# Altium schematic sheet JetsonXavier_v1.SchDoc
size A2
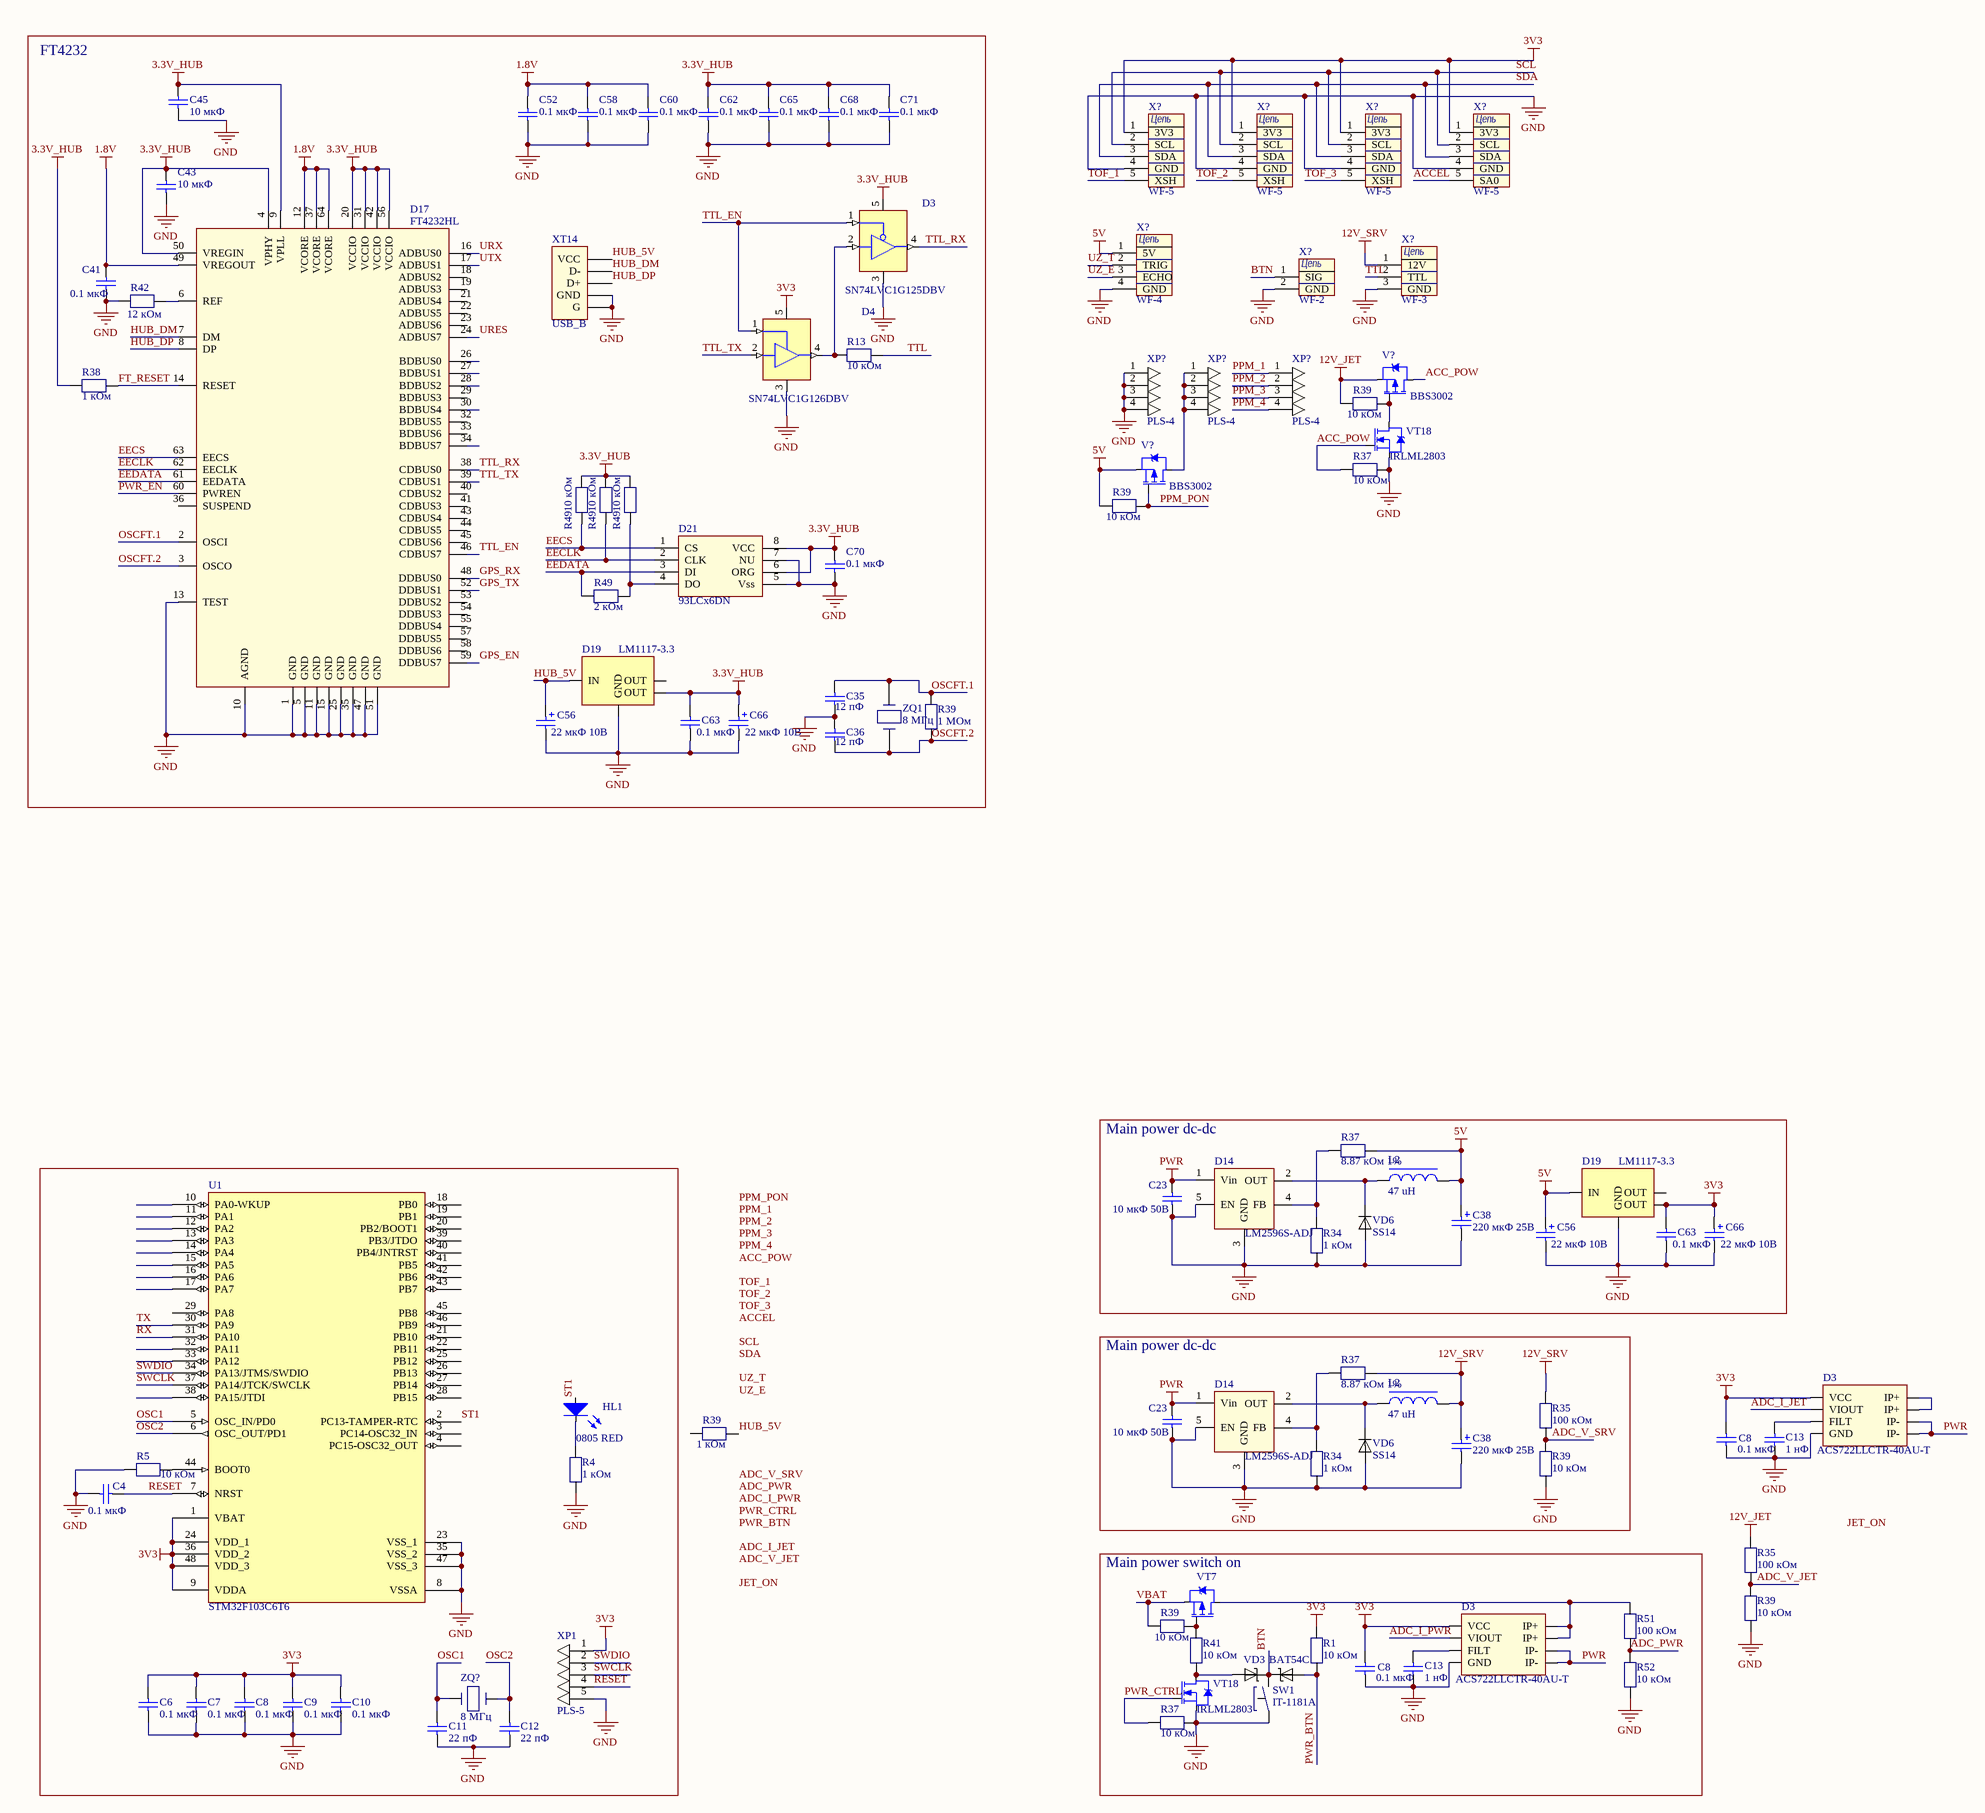
[diagram p0: JetsonXavier_v1.SchDoc]

## Parts
(Parts that share a designator on the sheet are numbered #1, #2 ... from top to bottom, then left to right.)
C4  value 0.1 мкФ  [0805]  (hidden comment: C0805)
C6  value 0.1 мкФ  [0805]  (hidden comment: C0805)
C7  value 0.1 мкФ  [0805]  (hidden comment: C0805)
C8#1  value 0.1 мкФ  [0805]  (hidden comment: C0805)
C8#2  value 0.1 мкФ  [0805]  (hidden comment: C0805)
C8#3  value 0.1 мкФ  [0805]  (hidden comment: C0805)
C9  value 0.1 мкФ  [0805]  (hidden comment: C0805)
C10  value 0.1 мкФ  [0805]  (hidden comment: C0805)
C11  value 22 пФ  [0805]  (hidden comment: C0805)
C12  value 22 пФ  [0805]  (hidden comment: C0805)
C13#1  value 1 нФ  [0805]  (hidden comment: C0805)
C13#2  value 1 нФ  [0805]  (hidden comment: C0805)
C23#1  value 10 мкФ 50В  [1206]  (hidden comment: C1206)
C23#2  value 10 мкФ 50В  [1206]  (hidden comment: C1206)
C35  value 12 пФ  [0805]  (hidden comment: C0805)
C36  value 12 пФ  [0805]  (hidden comment: C0805)
C38#1  220 мкФ 25В  [CAPPR3.5-8x12]
C38#2  220 мкФ 25В  [CAPPR3.5-8x12]
C41  value 0.1 мкФ  [0805]  (hidden comment: C0805)
C43  value 10 мкФ  [0805]  (hidden comment: C0805)
C45  value 10 мкФ  [0805]  (hidden comment: C0805)
C52  value 0.1 мкФ  [0805]  (hidden comment: C0805)
C56#1  22 мкФ 10В  [Case-B]
C56#2  22 мкФ 10В  [Case-B]
C58  value 0.1 мкФ  [0805]  (hidden comment: C0805)
C60  value 0.1 мкФ  [0805]  (hidden comment: C0805)
C62  value 0.1 мкФ  [0805]  (hidden comment: C0805)
C63#1  value 0.1 мкФ  [0805]  (hidden comment: C0805)
C63#2  value 0.1 мкФ  [0805]  (hidden comment: C0805)
C65  value 0.1 мкФ  [0805]  (hidden comment: C0805)
C66#1  22 мкФ 10В  [Case-B]
C66#2  22 мкФ 10В  [Case-B]
C68  value 0.1 мкФ  [0805]  (hidden comment: C0805)
C70  value 0.1 мкФ  [0805]  (hidden comment: C0805)
C71  value 0.1 мкФ  [0805]  (hidden comment: C0805)
D3#1  SN74LVC1G125DBV  [SOT23-5]
D3#2  ACS722LLCTR-40AU-T  [SOIC-8]
D3#3  ACS722LLCTR-40AU-T  [SOIC-8]
D4  SP: SN74LVC1G126DBV  [SOT23-5]  (hidden comment: SN74LVC1G126DBV_1)
D14#1  LM2596S-ADJ  [TO-263]
D14#2  LM2596S-ADJ  [TO-263]
D17  FT4232HL  [FT4232HL]
D19#1  LM1117-3.3  [SOT223]
D19#2  LM1117-3.3  [SOT223]
D21  93LCx6DN  [SOIC-8]
HL1  0805 RED  [LED0805]
L2#1  47 uH  [CDRH127]
L2#2  47 uH  [CDRH127]
R1  10 кОм  [R0603]
R4  value 1 кОм  [P0805]  (hidden comment: R0805 (1%))
R5  value 10 кОм  [P0805]  (hidden comment: R0805)
R13  value 10 кОм  [P0805]  (hidden comment: R0805 (1%))
R34#1  value 1 кОм  [P0805]  (hidden comment: R0805 (1%))
R34#2  value 1 кОм  [P0805]  (hidden comment: R0805 (1%))
R35#1  value 100 кОм  [P0805]  (hidden comment: R0805 (1%))
R35#2  value 100 кОм  [P0805]  (hidden comment: R0805 (1%))
R37#1  value 10 кОм  [P0805]  (hidden comment: R0805)
R37#2  value 8.87 кОм 1%  [P0805]  (hidden comment: R0805 (1%))
R37#3  value 8.87 кОм 1%  [P0805]  (hidden comment: R0805 (1%))
R37#4  value 10 кОм  [P0805]  (hidden comment: R0805)
R38  value 1 кОм  [P0805]  (hidden comment: R0805)
R39#1  value 10 кОм  [P0805]  (hidden comment: R0805 (1%))
R39#2  value 10 кОм  [P0805]  (hidden comment: R0805 (1%))
R39#3  value 1 МОм  [P0805]  (hidden comment: R0805)
R39#4  value 1 кОм  [P0805]  (hidden comment: R0805 (1%))
R39#5  value 10 кОм  [P0805]  (hidden comment: R0805 (1%))
R39#6  value 10 кОм  [P0805]  (hidden comment: R0805 (1%))
R39#7  value 10 кОм  [P0805]  (hidden comment: R0805 (1%))
R41  value 10 кОм  [P0805]  (hidden comment: R0805 (1%))
R42  value 12 кОм  [P0805]  (hidden comment: R0805)
R49#1  value 10 кОм  [P0805]  (hidden comment: R0805)
R49#2  value 10 кОм  [P0805]  (hidden comment: R0805)
R49#3  value 10 кОм  [P0805]  (hidden comment: R0805)
R49#4  value 2 кОм  [P0805]  (hidden comment: R0805)
R51  value 100 кОм  [P0805]  (hidden comment: R0805 (1%))
R52  value 10 кОм  [P0805]  (hidden comment: R0805 (1%))
SW1  IT-1181A  [IT-1181A]
U1  STM32F103C6T6  [LQFP-48]
V?#1  BBS3002  [TO-263-2]
V?#2  BBS3002  [TO-263-2]
VD3  BAT54C  [SOT-23]
VD6#1  SS14  [SMA]
VD6#2  SS14  [SMA]
VT7  D2PAK_P_CH  [TO-263-2]  (value not drawn)
VT18#1  IRLML2803  [SOT-23]
VT18#2  IRLML2803  [SOT-23]
X?#1  WF-5  [WF-5]
X?#2  WF-5  [WF-5]
X?#3  WF-5  [WF-5]
X?#4  WF-5  [WF-5]
X?#5  WF-4  [WF-4]
X?#6  WF-3  [WF-3]
X?#7  WF-2  [WF-2]
XP1  PLS-5  [PLS-5]
XP?#1  PLS-4  [PLS-4]
XP?#2  PLS-4  [PLS-4]
XP?#3  PLS-4  [PLS-4]
XT14  USB_B  [USB_B]
ZQ1  8 МГц  [HC-49/U]
ZQ?  8 МГц  [HC-49/U]

## Blocks framed on the sheet
FT4232: C35 C36 C41 C43 C45 C52 C56#1 C58 C60 C62 C63#1 C65 C66#1 C68 C70 C71 D3#1 D4 D17 D19#1 D21 R13 R38 R39#3 R42 R49#1-R49#4 XT14 ZQ1
Main power dc-dc: C23#1 C38#1 C56#2 C63#2 C66#2 D14#1 D19#2 L2#1 R34#1 R37#2 VD6#1
Main power dc-dc: C23#2 C38#2 D14#2 L2#2 R34#2 R35#1 R37#3 R39#5 VD6#2
Main power switch on: C8#2 C13#2 D3#3 R1 R37#4 R39#7 R41 R51 R52 SW1 VD3 VT7 VT18#2

## Nets
1.8V: C41.2 C52.2 C58.2 C60.2 D17.12(VCORE) D17.37(VCORE) D17.49(VREGOUT) D17.64(VCORE)
3.3V_HUB: C43.2 C45.2 C62.2 C63#1.2 C65.2 C66#1.1 C68.2 C70.2 C71.2 D3#1.5(VCC) D17.4(VPHY) D17.9(VPLL) D17.20(VCCIO) D17.31(VCCIO) D17.42(VCCIO) D17.50(VREGIN) D17.56(VCCIO) D19#1.4(OUT) D21.6(ORG) D21.8(VCC) R38.2 R49#1.1 R49#2.1 R49#3.1
3V3: C6.2 C7.2 C8#1.1 C8#2.1 C8#3.2 C9.2 C10.2 C63#2.2 C66#2.1 D3#2.8(VCC) D3#3.8(VCC) D4.5(VCC) D19#2.4(OUT) R1.2 U1.1(VBAT) U1.9(VDDA) U1.24(VDD_1) U1.36(VDD_2) U1.48(VDD_3) X?#1.1(3V3) X?#2.1(3V3) X?#3.1(3V3) X?#4.1(3V3) XP1.1
5V: C38#1.1 C56#2.1 D19#2.3(IN) L2#1.2 R37#2.1 R39#2.1 V?#2.3(S) X?#5.1(5V)
12V_JET: R35#2.2 R39#1.1 V?#1.3(S)
12V_SRV: C38#2.1 L2#2.2 R35#1.2 R37#3.1 X?#6.1(12V)
GND: C4.2 C6.1 C7.1 C8#1.2 C8#2.2 C8#3.1 C9.1 C10.1 C11.1 C12.1 C13#1.1 C13#2.1 C23#1.2 C23#2.2 C35.1 C36.2 C38#1.2 C38#2.2 C41.1 C43.1 C45.1 C52.1 C56#1.2 C56#2.2 C58.1 C60.1 C62.1 C63#1.1 C63#2.1 C65.1 C66#1.2 C66#2.2 C68.1 C70.1 C71.1 D3#1.3(GND) D3#2.5(GND) D3#3.5(GND) D4.3(GND) D14#1.3(GND) D14#1.5(EN) D14#2.3(GND) D14#2.5(EN) D17.1(GND) D17.5(GND) D17.10(AGND) D17.11(GND) D17.13(TEST) D17.15(GND) D17.25(GND) D17.35(GND) D17.47(GND) D17.51(GND) D19#1.1(GND) D19#2.1(GND) D21.5(Vss) D21.7(NU) R4.1 R5.2 R34#1.1 R34#2.1 R37#1.1 R37#4.1 R39#5.2 R39#6.2 R42.2 R52.2 SW1.1 U1.8(VSSA) U1.23(VSS_1) U1.35(VSS_2) U1.47(VSS_3) VD6#1.2(A) VD6#2.2(A) VT18#1.2(S) VT18#2.2(S) X?#1.4(GND) X?#2.4(GND) X?#3.4(GND) X?#4.4(GND) X?#5.4(GND) X?#6.3(GND) X?#7.2(GND) XP1.5 XP?#1.1 XP?#1.2 XP?#1.3 XP?#1.4 XT14.4(GND) XT14.G
PWR: C23#1.1 C23#2.1 D3#2.3(IP-) D3#2.4(IP-) D3#3.3(IP-) D3#3.4(IP-) D14#1.1(Vin) D14#2.1(Vin)
ACC_POW: R37#1.2 V?#1.2(D) VT18#1.1(G)
ACCEL: X?#4.5(SA0)
ADC_I_JET: D3#2.7(VIOUT)
ADC_I_PWR: D3#3.7(VIOUT)
ADC_PWR: R51.1 R52.1
ADC_V_JET: R35#2.1 R39#6.1
ADC_V_SRV: R35#1.1 R39#5.1
BTN: SW1.2 VD3.3(K) X?#7.1(SIG)
EECLK: D17.62(EECLK) D21.2(CLK) R49#2.2
EECS: D17.63(EECS) D21.1(CS) R49#1.2
EEDATA: D17.61(EEDATA) D21.3(DI) R49#4.2
FT_RESET: D17.14(RESET) R38.1
GPS_EN: D17.59(DDBUS7)
GPS_RX: D17.48(DDBUS0)
GPS_TX: D17.52(DDBUS1)
HUB_5V: C56#1.1 D19#1.3(IN) R39#4.2 XT14.1(VCC)
HUB_DM: D17.7(DM) XT14.2(D-)
HUB_DP: D17.8(DP) XT14.3(D+)
OSC1: C11.2 U1.5(OSC_IN/PD0) ZQ?.1
OSC2: C12.2 U1.6(OSC_OUT/PD1) ZQ?.2
OSCFT.1: C35.2 D17.2(OSCI) R39#3.1 ZQ1.2
OSCFT.2: C36.1 D17.3(OSCO) R39#3.2 ZQ1.1
PPM_1: XP?#3.1
PPM_2: XP?#3.2
PPM_3: XP?#3.3
PPM_4: XP?#3.4
PPM_PON: R39#2.2 V?#2.1(G)
PWR_BTN: R1.1 VD3.2(A)
PWR_CTRL: R37#4.2 VT18#2.1(G)
PWR_EN: D17.60(PWREN)
RESET: C4.1 U1.7(NRST) XP1.4
RX: U1.31(PA10)
SCL: X?#1.2(SCL) X?#2.2(SCL) X?#3.2(SCL) X?#4.2(SCL)
SDA: X?#1.3(SDA) X?#2.3(SDA) X?#3.3(SDA) X?#4.3(SDA)
ST1: HL1.1(A) U1.2(PC13-TAMPER-RTC)
SWCLK: U1.37(PA14/JTCK/SWCLK) XP1.3
SWDIO: U1.34(PA13/JTMS/SWDIO) XP1.2
TOF_1: X?#1.5(XSH)
TOF_2: X?#2.5(XSH)
TOF_3: X?#3.5(XSH)
TTL: R13.2 X?#6.2(TTL)
TTL_EN: D3#1.1(A) D4.1(A) D17.46(CDBUS7)
TTL_RX: D3#1.4(OUT) D17.38(CDBUS0)
TTL_TX: D4.2(B) D17.39(CDBUS1)
TX: U1.30(PA9)
URES: D17.24(ADBUS7)
URX: D17.16(ADBUS0)
UTX: D17.17(ADBUS1)
UZ_E: X?#5.3(ECHO)
UZ_T: X?#5.2(TRIG)
VBAT: R39#7.1 VT7.3(S)
NetC13#1_2: C13#1.2 D3#2.6(FILT)
NetC13#2_2: C13#2.2 D3#3.6(FILT)
NetD3#1_2: D3#1.2(B) D4.4(OUT) R13.1
NetD3#2_1: D3#2.1(IP+) D3#2.2(IP+)
NetD3#3_1: D3#3.1(IP+) D3#3.2(IP+) R51.2 VT7.2(D)
NetD14#1_2: D14#1.2(OUT) L2#1.1 VD6#1.1(K)
NetD14#1_4: D14#1.4(FB) R34#1.2 R37#2.2
NetD14#2_2: D14#2.2(OUT) L2#2.1 VD6#2.1(K)
NetD14#2_4: D14#2.4(FB) R34#2.2 R37#3.2
NetD17_6: D17.6(REF) R42.1
NetD21_4: D21.4(DO) R49#3.2 R49#4.1
NetHL1_2: HL1.2(C) R4.2
NetR5_1: R5.1 U1.44(BOOT0)
NetR39#1_2: R39#1.2 V?#1.1(G) VT18#1.3(D)
NetR39#7_2: R39#7.2 R41.1 VT7.1(G)
NetR41_2: R41.2 VD3.1(A) VT18#2.3(D)
NetV?#2_2: V?#2.2(D) XP?#2.1 XP?#2.2 XP?#2.3 XP?#2.4

Not connected (* = marked no-connect by the designer): D17 18(ADBUS2) 19(ADBUS3) 21(ADBUS4) 22(ADBUS5) 23(ADBUS6) 26(BDBUS0) 27(BDBUS1) 28(BDBUS2) 29(BDBUS3) 30(BDBUS4) 32(BDBUS5) 33(BDBUS6) 34(BDBUS7) 36(SUSPEND) 40(CDBUS2) 41(CDBUS3) 43(CDBUS4) 44(CDBUS5) 45(CDBUS6) 53(DDBUS2) 54(DDBUS3) 55(DDBUS4) 57(DDBUS5) 58(DDBUS6); D19#1 2(OUT); D19#2 2(OUT); R39#4 1; U1 3(PC14-OSC32_IN) 4(PC15-OSC32_OUT) 10(PA0-WKUP) 11(PA1) 12(PA2) 13(PA3) 14(PA4) 15(PA5) 16(PA6) 17(PA7) 18(PB0) 19(PB1) 20(PB2/BOOT1) 21(PB10) 22(PB11) 25(PB12) 26(PB13) 27(PB14) 28(PB15) 29(PA8) 32(PA11) 33(PA12) 38(PA15/JTDI) 39(PB3/JTDO) 40(PB4/JNTRST) 41(PB5) 42(PB6) 43(PB7) 45(PB8) 46(PB9)

## Notes on the sheet
- Labels drawn without touching a wire or pin: ACC_POW, ACCEL, ADC_I_JET, ADC_I_PWR, ADC_PWR, ADC_V_JET, ADC_V_SRV, JET_ON, PPM_1, PPM_2, PPM_3, PPM_4, PPM_PON, PWR_BTN, PWR_CTRL, SCL, SDA, TOF_1, TOF_2, TOF_3, UZ_E, UZ_T
- (in symbol WF-2) Цепь
- (in symbol WF-3) Цепь
- (in symbol WF-4) Цепь
- (in symbol WF-5) Цепь

## Library data of the parts
C4 C6 C7 C8#1-C8#3 C9-C12 C13#1 C13#2 C35 C36 C41 C43 C45 C52 C58 C60 C62 C63#1 C63#2 C65 C68 C70 C71 = C0805: Чип конденсатор 0805; SP: Чип конденсатор 0805 X7R
C23#1 C23#2 = C1206: Чип конденсатор 1206; SP: Чип конденсатор 1206 X7R
C38#1 C38#2 = K50-35: Чип конденсатор танталовый "A"; SP: Конденсатор  SH025M0220A5S-0811; Value: 220 мкФ 25В
C56#1 C56#2 C66#1 C66#2 = Tantal "B": Чип конденсатор танталовый "B"; SP: Чип конденсатор Tantal "B"; Value: 22 мкФ 10В
D3#2 D3#3 = ACS712: SP: ACS722LLCTR-40AU-T
D14#1 D14#2 = LM2596S-ADJ: SP: Микросхема LM2596S-ADJ
D19#1 D19#2 = LM1117: SP: LM1117-3.3
D21 = 93LC46: Microwire Serial EEPROM; Value: EEPROM; SP: 93LCx6DN
HL1 = LED: Value: 0805 RED
L2#1 L2#2 = CDRH127/LDNP-330MC: SMD Дроссель 12x12 mm; SP: CDRH127/LDNP-330MC; Value: 47 uH
R1 = R0603: Чип резистор 0603; SP: Чип резистор 0603; FootPrint: 0603; Value: 10 кОм
R4 R13 R34#1 R34#2 R35#1 R35#2 R37#2 R37#3 R39#1 R39#2 R39#4-R39#7 R41 R51 R52 = R0805 (1%): Чип резистор 0805, 1%; SP: Чип резистор 0805
R5 R37#1 R37#4 R38 R39#3 R42 R49#1-R49#4 = R0805: Чип резистор 0805, 1%; SP: Чип резистор 0805
SW1 = SWT-1: SP: IT-1181A
U1 = STM32F103C6T6: STM32 ARM-based 32-bit MCU with 32 Kbytes Flash, 48-pin LQFP, Industrial Temperature; Published: 30-May-2008; DatasheetVersion: rev6, Mar-2008; PackageVersion: Mar-2008; PackageReference: LQFP48; Publisher: Altium Limited; PackageDescription: 48-Pin Low-Profile Quad Flat Pack, 7 x 7 mm Body, 0.5 mm Pitch (LQFP48); ComponentLink1Description: Manufacturer Link; ComponentLink1URL: www.st.com/stm32; ComponentLink2Description: Datasheet; ComponentLink2URL: http://www.st.com/stonline/products/literature/ds/13587.pdf; SP: STM32F103C6T6
VD6#1 VD6#2 = diode: SP: SS14
VT7 = D2PAK_P_CH: SP: D2PAK P channel transistor
VT18#1 VT18#2 = IRLML2803: IRLML2803 Полевой транзистор; SP: Транзистор IRLML2803
X?#1-X?#4 = WF-5: Вилка на плату 2.54; SP: WR-5, Вилка на плату 2.54
X?#5 = WF-4: Вилка на плату 2.54; SP: WR-4, Вилка на плату 2.54
X?#6 = WF-3: Вилка на плату 2.54; SP: WR-3, Вилка на плату 2.54
X?#7 = WF-2: Вилка на плату 2.54; SP: WR-2, Вилка на плату 2.54
XP?#1-XP?#3 = PLS-4: Вилка угловая однорядная, шаг 2,54мм; Value: PLS-4; SP: PLS-4
XT14 = USB_A/B: SP: USB_B
ZQ1 = HC49U-8M0: Кварцевый резонатор d3x8мм; SP: HC49S; Value: 8 МГц
ZQ? = HC49U-8M0: Кварцевый резонатор d3x8мм; Value: 16 МГц; SP: HC49S
D3#1 = SN74LVC1G125DBV: SP: SN74LVC1G125DBV
D17 = FT4232HL: SP: FT4232HL
V?#1 V?#2 = BBS3002: Value: BBS3002
VD3 = BAT54C: SP: BAT54C
XP1 = PLS-5: SP: PLS-5